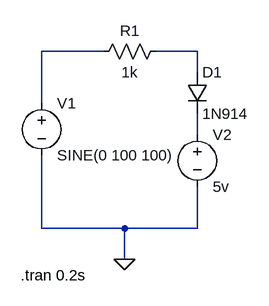
[diagram p0: schematic 6.Shunt Clipper(PP).asc]
6.Shunt Clipper(PP).asc, the LTspice schematic file:
Version 4
SHEET 1 880 680
WIRE 256 16 160 16
WIRE 400 16 336 16
WIRE 400 48 400 16
WIRE 160 96 160 16
WIRE 400 144 400 112
WIRE 160 288 160 176
WIRE 288 288 160 288
WIRE 400 288 400 224
WIRE 400 288 288 288
WIRE 288 336 288 288
FLAG 288 336 0
SYMBOL voltage 160 80 R0
WINDOW 123 0 0 Left 0
WINDOW 39 0 0 Left 0
SYMATTR InstName V1
SYMATTR Value SINE(0 100 100)
SYMBOL res 352 0 R90
WINDOW 0 0 56 VBottom 2
WINDOW 3 32 56 VTop 2
SYMATTR InstName R1
SYMATTR Value 1k
SYMBOL diode 384 48 R0
SYMATTR InstName D1
SYMATTR Value 1N914
SYMBOL voltage 400 128 R0
SYMATTR InstName V2
SYMATTR Value 5v
TEXT 128 360 Left 2 !.tran 0.2s

The netlist it stands for:
* 6.Shunt Clipper(PP).asc
V1 N001 0 SINE(0 100 100)
R1 N002 N001 1k
D1 N002 N003 1N914
V2 N003 0 5v
.model D D
.lib standard.dio
.tran 0.2s
.backanno
.end